# Altium schematic sheet Motors.SchDoc: Top Level
size A3; CompanyName: NOT USED; DocumentNumber: 9; SheetNumber: 9; SheetTotal: 10; PageSetup: Record=PageOptions|CenterHorizontal=True|CenterVertical=True|PrintScale=1.00|XCorrection=1.00|YCorrection=1.00|PrintKind=0|BorderSize=5000000|LeftOffset=0|BottomOffset=0|Orientation=2|PaperLength=1000|PaperWidth=1000|Scale=100|PaperSource=7|PrintQuality=-4|MediaType=1|DitherType=10|PaperKind=A3|PrintScaleMode=0
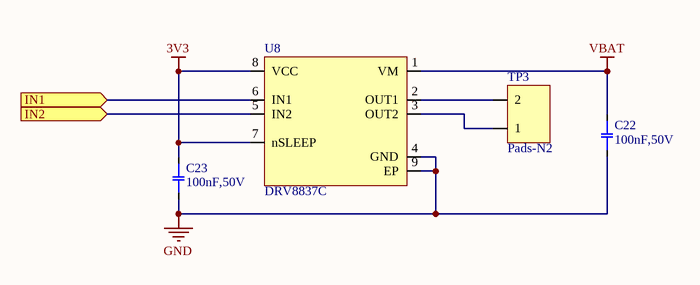
[diagram p0: Motors.SchDoc]

## Parts
C22  100nF,50V  [CAPC1608X09N_0603]
C23  100nF,50V  [CAPC1608X09N_0603]
TP3  Pads-N2  [PADS-N2]
U8  DRV8837C  [DFN50P200X200X80-8N]

## Ports
IN1 (in), IN2 (in)

## Nets
3V3: C23.2 U8.7(nSLEEP) U8.8(VCC)
GND: C22.1 C23.1 U8.4(GND) U8.9(EP)
VBAT: C22.2 U8.1(VM)
IN1: U8.6(IN1) ; port IN1
IN2: U8.5(IN2) ; port IN2
NetTP3_1: TP3.1 U8.3(OUT2)
NetTP3_2: TP3.2 U8.2(OUT1)

## Notes on the sheet
- Project
- Size:
- Date:
- A3
- Revision:
- Sheet
- of
- Lambo
- File:

## Library data of the parts
C22 C23 = CCH-104CH-G: CAP CER 0.1UF 50V 10% X7R 0603; Manufacturer: Kemet; Manufacturer Part Number: C0603C104K5RACTU; Type: Ceramic; Display_Name: 100nF,50V; Capacitance: 100nF; Dielectric: X7R; Tolerance: 10%; Voltage: 50V; BWA PN: CCH-104CH-G; Schematic Symbol: CAP-NP_1; Supplier 1: Digi-Key; Supplier Part Number 1: 399-5089-1-ND
U8 = ICT-10892-A: IC HALF-BRIDGE DRVR PWM 8WSON; Manufacturer: Texas Instruments; Manufacturer Part Number: DRV8837CDSGR; Temp Range: -40°C ~ 85°C; Display_Name: DRV8837C; BWA PN: ICT-10892-A; Schematic Symbol: DRV8837C; Supplier 1: Digi-Key; Supplier Part Number 1: 296-47205-1-ND